# Altium schematic sheet 05 POWER DOMAIN.SchDoc
size 513 x 386 mm
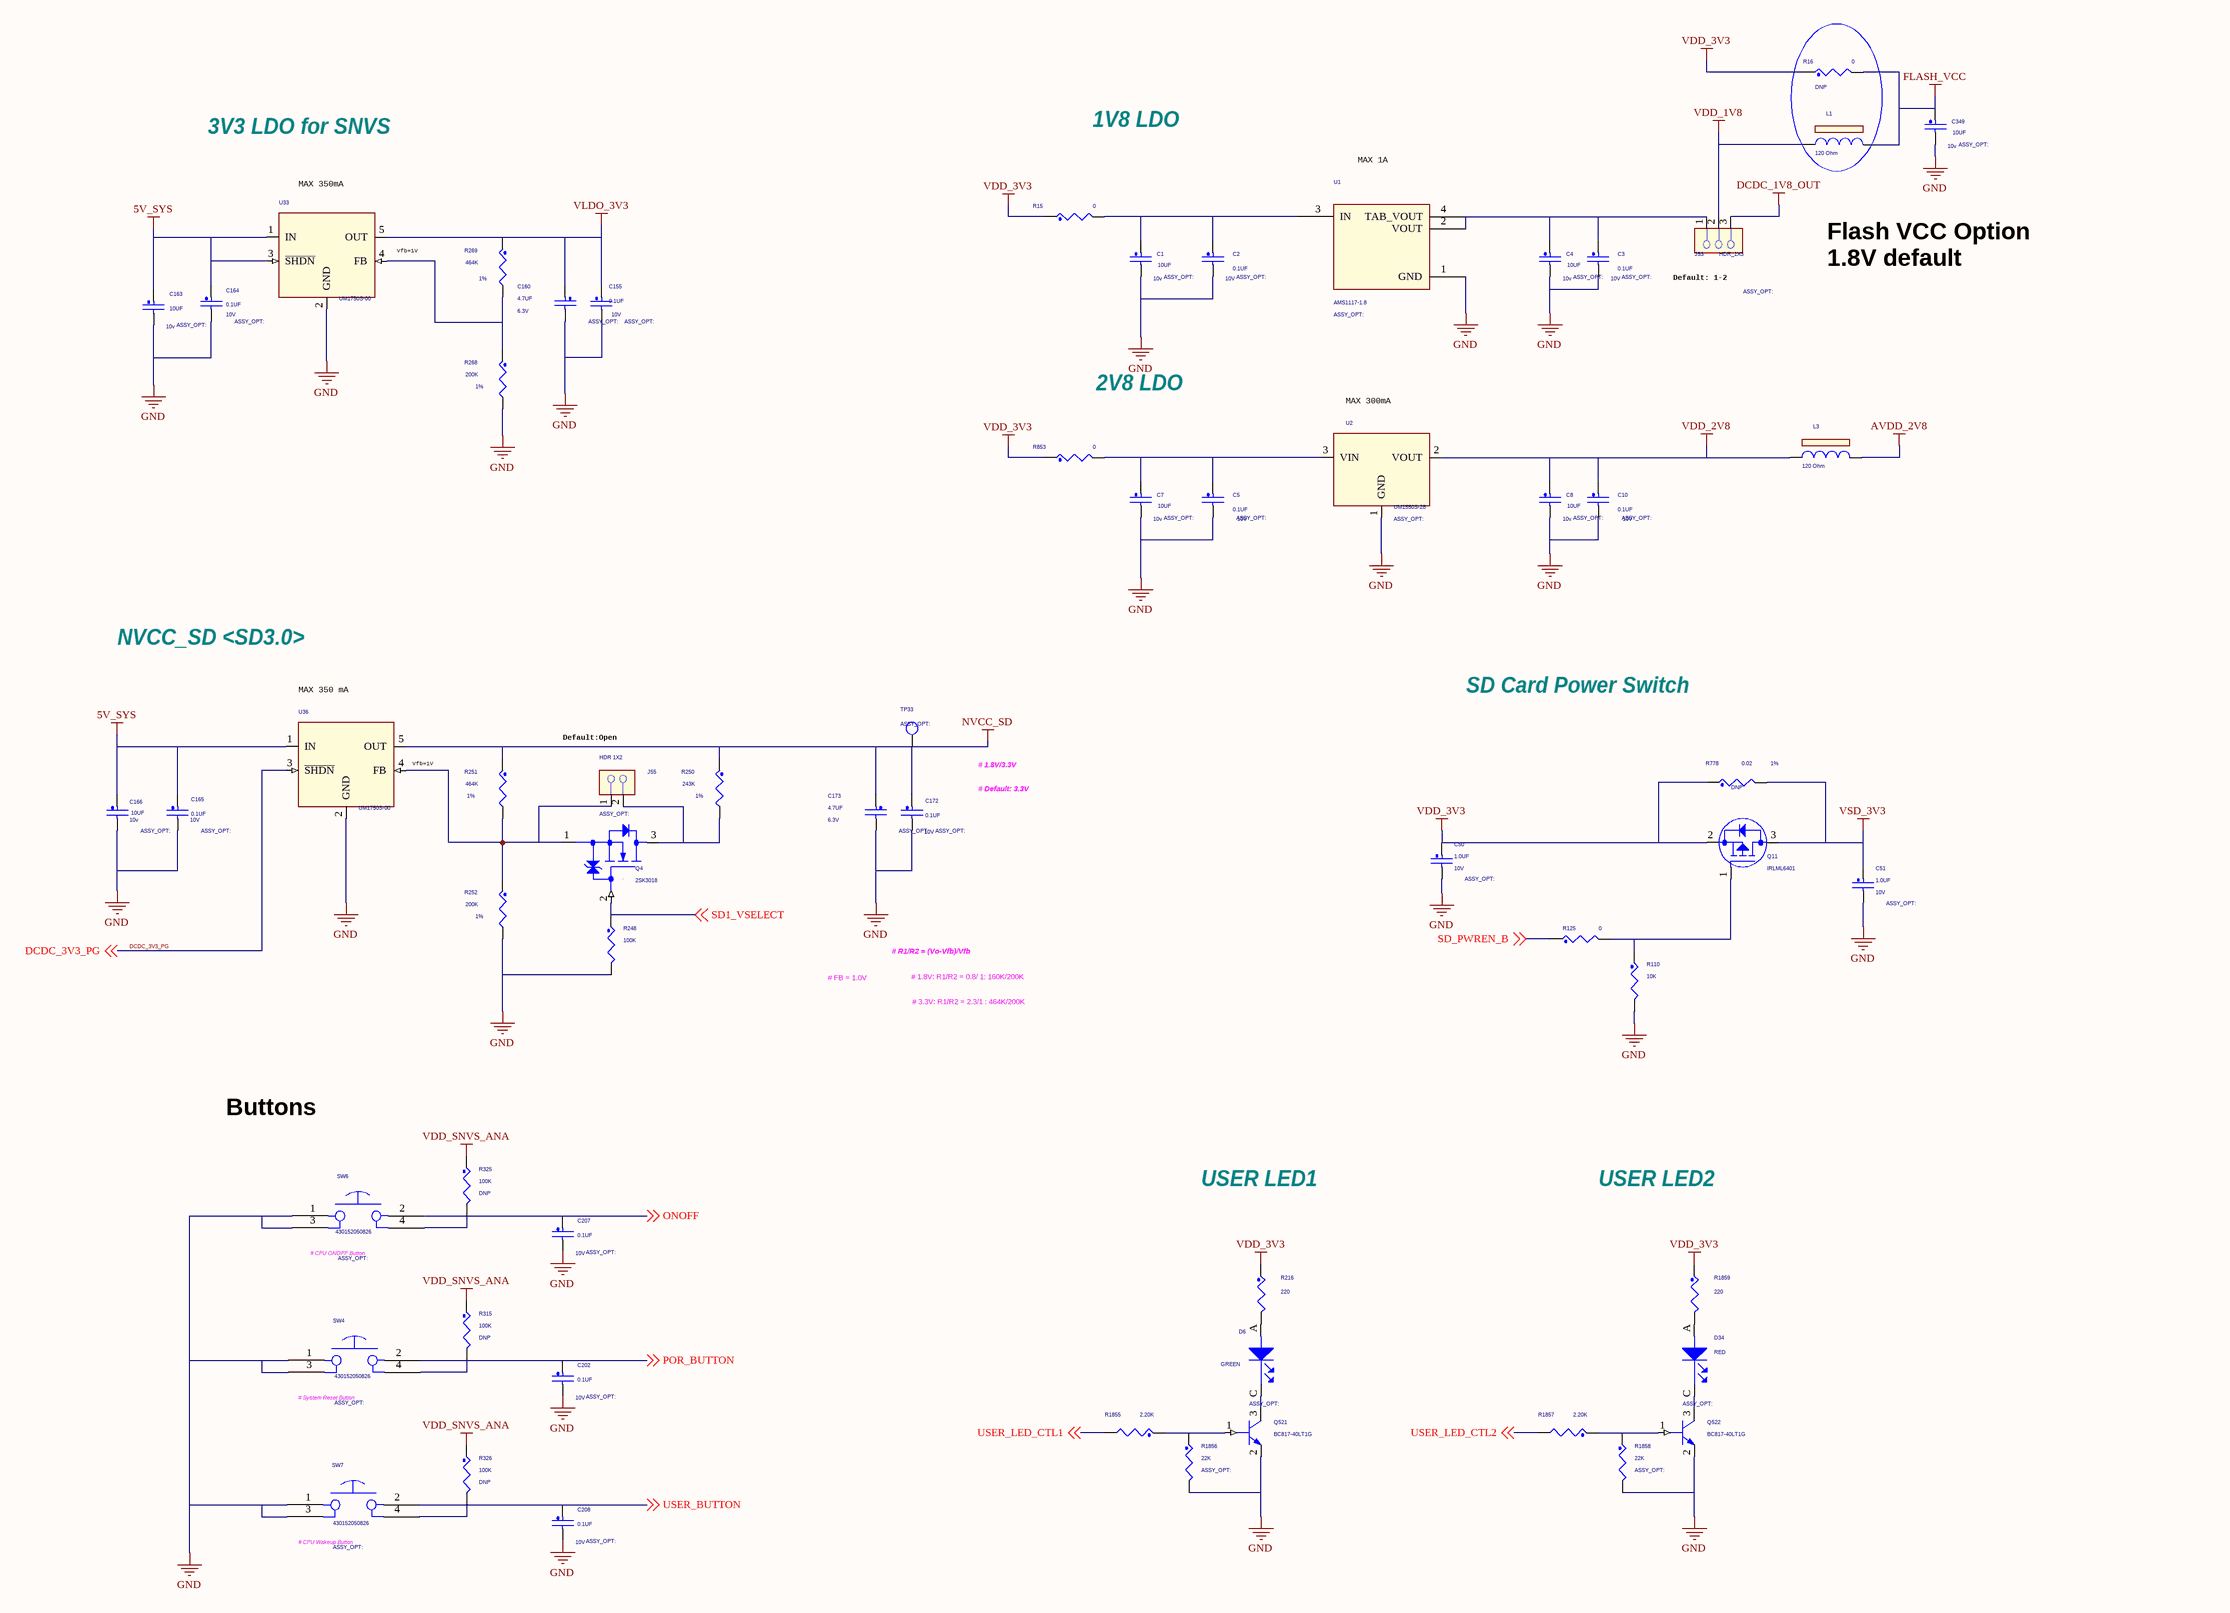
[diagram p0: 05 POWER DOMAIN.SchDoc]

## Parts
C1  10UF  VOLTAGE: 10v  [CC0603_OV]
C2  0.1UF  VOLTAGE: 10V  [0402_CC]
C3  0.1UF  VOLTAGE: 10V  [0402_CC]
C4  10UF  VOLTAGE: 10v  [CC0603_OV]
C5  0.1UF  VOLTAGE: 10V  [0402_CC]
C7  10UF  VOLTAGE: 10v  [CC0603_OV]
C8  10UF  VOLTAGE: 10v  [CC0603_OV]
C10  0.1UF  VOLTAGE: 10V  [0402_CC]
C50  1.0UF  VOLTAGE: 10V  [0402_CC]
C51  1.0UF  VOLTAGE: 10V  [0402_CC]
C155  0.1UF  VOLTAGE: 10V  [0402_CC]
C160  4.7UF  voltage rating: 6.3V  [cc0402_tol0p15]
C163  10UF  VOLTAGE: 10v  [CC0603_OV]
C164  0.1UF  VOLTAGE: 10V  [0402_CC]
C165  0.1UF  VOLTAGE: 10V  [0402_CC]
C166  10UF  VOLTAGE: 10v  [CC0603_OV]
C172  0.1UF  VOLTAGE: 10V  [0402_CC]
C173  4.7UF  voltage rating: 6.3V  [cc0402_tol0p15]
C202  0.1UF  VOLTAGE: 10V  [0402_CC]
C207  0.1UF  VOLTAGE: 10V  [0402_CC]
C208  0.1UF  VOLTAGE: 10V  [0402_CC]
C349  10UF  VOLTAGE: 10v  [CC0603_OV]
D6  GREEN  [LED_0603]
D34  RED  [LED_0603]
J53  HDR_1X3  [HDR103]
J55  HDR 1X2  [HDR102]
L1  120 Ohm  [0402_CC]
L3  120 Ohm  [0402_CC]
Q4  2SK3018  [SOT323_3]
Q11  IRLML6401  [sot-23]
Q521  BC817-40LT1G  [SOT23]
Q522  BC817-40LT1G  [SOT23]
R15  0  [0402_CC]
R16  0  ASSY_OPT: DNP  [0402_CC]
R110  10K  [0402_CC]
R125  0  [0402_CC]
R216  220  [RC0603_OV]
R248  100K  [0402_CC]
R250  243K  Tolerance: 1%  [0402_CC]
R251  464K  Tolerance: 1%  [0402_CC]
R252  200K  Tolerance: 1%  [0402_CC]
R268  200K  Tolerance: 1%  [0402_CC]
R269  464K  Tolerance: 1%  [0402_CC]
R315  100K  ASSY_OPT: DNP  [0402_CC]
R325  100K  ASSY_OPT: DNP  [0402_CC]
R326  100K  ASSY_OPT: DNP  [0402_CC]
R778  0.02  TOL: 1%  ASSY_OPT: DNP  [RC0603_OV]
R853  0  [0402_CC]
R1855  2.20K  [RC0603_OV]
R1856  22K  [RC0402_25]
R1857  2.20K  [RC0603_OV]
R1858  22K  [RC0402_25]
R1859  220  [RC0603_OV]
SW4  430152050826  [sw4_pb_6p2sq_sm]
SW6  430152050826  [sw4_pb_6p2sq_sm]
SW7  430152050826  [sw4_pb_6p2sq_sm]
TP33  TP_35MIL  [testpoint_35mil]  (value not drawn)
U1  AMS1117-1.8  [sot223]
U2  UM1550S-28  [sot23-3-1p95]
U33  UM1750S-00  [sot23-5_a]
U36  UM1750S-00  [sot23-5_a]

## Nets
5V_SYS: C163.1 C164.1 C165.1 C166.1 U33.1(IN) U33.3(~{SHDN}) U36.1(IN)
AVDD_2V8: L3.2
DCDC_1V8_OUT: J53.3
FLASH_VCC: C349.1 L1.2 R16.2
GND: C1.2 C2.2 C3.2 C4.2 C5.2 C7.2 C8.2 C10.2 C50.2 C51.2 C155.2 C160.2 C163.2 C164.2 C165.2 C166.2 C172.2 C173.2 C202.2 C207.2 C208.2 C349.2 Q521.2(EMITTER) Q522.2(EMITTER) R110.2 R248.2 R252.2 R268.2 R1856.2 R1858.2 SW4.1 SW4.3 SW6.1 SW6.3 SW7.1 SW7.3 U1.1(GND) U2.1(GND) U33.2(GND) U36.2(GND)
NVCC_SD: C172.1 C173.1 R250.1 R251.1 TP33.1(TP) U36.5(OUT)
VDD_1V8: J53.2 L1.1
VDD_2V8: C8.1 C10.1 L3.1 U2.2(VOUT)
VDD_3V3: C50.1 Q11.2(SOURCE) R15.1 R16.1 R216.1 R778.1 R853.1 R1859.1
VDD_SNVS_ANA: R315.1 R325.1 R326.1
VLDO_3V3: C155.1 C160.1 R269.1 U33.5(OUT)
VSD_3V3: C51.1 Q11.3(DRAIN) R778.2
DCDC_3V3_PG: U36.3(~{SHDN}) ; off-sheet DCDC_3V3_PG
ONOFF: C207.1 R325.2 SW6.2 SW6.4 ; off-sheet ONOFF
POR_BUTTON: C202.1 R315.2 SW4.2 SW4.4 ; off-sheet POR_BUTTON
SD1_VSELECT: Q4.2(GATE) R248.1 ; off-sheet SD1_VSELECT
SD_PWREN_B: R125.1 ; off-sheet SD_PWREN_B
USER_BUTTON: C208.1 R326.2 SW7.2 SW7.4 ; off-sheet USER_BUTTON
USER_LED_CTL1: R1855.2 ; off-sheet USER_LED_CTL1
USER_LED_CTL2: R1857.2 ; off-sheet USER_LED_CTL2
NetC1_1: C1.1 C2.1 R15.2 U1.3(IN)
NetC3_1: C3.1 C4.1 J53.1 U1.2(VOUT) U1.4(TAB_VOUT)
NetC5_1: C5.1 C7.1 R853.2 U2.3(VIN)
NetD6_A: D6.A(ANODE) R216.2
NetD6_C: D6.C(CATHODE) Q521.3(COLLECTOR)
NetD34_A: D34.A(ANODE) R1859.2
NetD34_C: D34.C(CATHODE) Q522.3(COLLECTOR)
NetJ55_1: J55.1 Q4.1(SOURCE) R251.2 R252.1 U36.4(FB)
NetJ55_2: J55.2 Q4.3(DRAIN) R250.2
NetQ11_1: Q11.1(GATE) R110.1 R125.2
NetQ521_1: Q521.1(BASE) R1855.1 R1856.1
NetQ522_1: Q522.1(BASE) R1857.1 R1858.1
NetR268_1: R268.1 R269.2 U33.4(FB)

## Notes on the sheet
- 3V3 LDO for SNVS
- 1V8 LDO
- MAX 1A
- (near U33) MAX 350mA
- Flash VCC Option
  1.8V default
- (near U33) Vfb=1V
- (near J53) Default: 1-2
- 2V8 LDO
- MAX 300mA
- NVCC_SD <SD3.0>
- MAX 350 mA
- SD Card Power Switch
- (near U36) Vfb=1V
- Default:Open
- # 1.8V/3.3V
- # Default: 3.3V
- # R1/R2 = (Vo-Vfb)/Vfb
- # FB = 1.0V
- # 1.8V: R1/R2 = 0.8/ 1: 160K/200K
- # 3.3V: R1/R2 = 2.3/1 : 464K/200K
- Buttons
- USER LED1
- USER LED2
- (near SW6) # CPU ONOFF Button
- (near SW4) # System Reset Button
- (near SW7) # CPU Wakeup Button

## Library data of the parts
C1 C4 C163 C349 = CAP_NP: CAP CER 10UF 10V 10% X5R 0603; CLASS: DISCRETE; AGILE_PN: 150-78675; MFG_NAME01: MURATA; MFG_PN01: GRM188R61A106KE69D; Temp_Range: -55¡ãC ~ 85¡ãC; CAD_APPROVED: Yes; FPLIST: CC0603_OV,CC0603,0603_CC; Tolerance: 10%; ROHS: Yes; HEIGHT: 1.016MM; Temp Range: -55¡ãC ~ 85¡ãC
C2 C3 C5 C10 C164 C172 C207 C208 = CAP_NP: CAP CER 0.1UF 10V 10% X5R 0402; CLASS: DISCRETE; AGILE_PN: 150-75634; MFG_NAME01: YAGEO AMERICA; MFG_PN01: CC0402KRX5R6BB104; CAD_APPROVED: Yes; FPLIST: CC0402_25,CC0402_HD,0402_CC; Tolerance: 10%; ROHS: Yes; HEIGHT: 0.64MM; Package Size: 0402
C7 C8 C166 = CAP_NP: CAP CER 10UF 10V 10% X5R 0603; CLASS: DISCRETE; FPLIST: CC0603_OV,CC0603,0603_CC; CAD_APPROVED: Yes; Temp_Range: -55¡ãC ~ 85¡ãC; MFG_PN01: GRM188R61A106KE69D; MFG_NAME01: MURATA; AGILE_PN: 150-78675; HEIGHT: 1.016MM; ROHS: Yes; Tolerance: 10%; Temp Range: -55¡ãC ~ 85¡ãC
C50 = CAP_NP: CAP CER 1.0UF 10V 10% X5R 0402; CLASS: DISCRETE; FPLIST: CC0402_25,CC0402_HD,0402_CC; CAD_APPROVED: Yes; MFG_PN01: CC0402KRX5R6BB105; MFG_NAME01: YAGEO AMERICA; AGILE_PN: 150-75772; HEIGHT: 0.6MM; ROHS: Yes; Package Size: 0402
C51 = CAP_NP: CAP CER 1.0UF 10V 10% X5R 0402; CLASS: DISCRETE; AGILE_PN: 150-75772; MFG_NAME01: YAGEO AMERICA; MFG_PN01: CC0402KRX5R6BB105; CAD_APPROVED: Yes; FPLIST: CC0402_25,CC0402_HD,0402_CC; ROHS: Yes; HEIGHT: 0.6MM; Package Size: 0402
C155 C165 C202 = CAP_NP: CAP CER 0.1UF 10V 10% X5R 0402; CLASS: DISCRETE; FPLIST: CC0402_25,CC0402_HD,0402_CC; CAD_APPROVED: Yes; MFG_PN01: CC0402KRX5R6BB104; MFG_NAME01: YAGEO AMERICA; AGILE_PN: 150-75634; HEIGHT: 0.64MM; ROHS: Yes; Tolerance: 10%; Package Size: 0402
C160 = CAP_NP: CAP CER 4.7UF 6.3V 20% X5R 0402; CLASS: DISCRETE; FPLIST: CC0402_25,CC0402_HD,0402_CC; CAD_APPROVED: Yes; MFG_PN01: C1005X5R0J475M050BC; MFG_NAME01: TDK; AGILE_PN: 150-78463; HEIGHT: 0.65MM; ROHS: Yes; Tolerance: 20%; VOLTAGE: 6.3V
C173 = CAP_NP: CAP CER 4.7UF 6.3V 20% X5R 0402; CLASS: DISCRETE; AGILE_PN: 150-78463; MFG_NAME01: TDK; MFG_PN01: C1005X5R0J475M050BC; CAD_APPROVED: Yes; FPLIST: CC0402_25,CC0402_HD,0402_CC; VOLTAGE: 6.3V; Tolerance: 20%; ROHS: Yes; HEIGHT: 0.65MM
D6 = LED: LED GRN SGL 25MA 0603; CLASS: IC; CAD_APPROVED: Yes; MFG_PN01: KPT-1608SGC; MFG_NAME01: KINGBRIGHT; AGILE_PN: 370-76549; HEIGHT: 0.85MM; ROHS: Yes
D34 = LED: LED ULTRA BRIGHT RED SGL 30MA 0603; CLASS: IC; Temp_Range: -30¡ã C to + 85¡ã C; CAD_APPROVED: Yes; MFG_PN01: LTST-C190KRKT; MFG_NAME01: LITE ON; AGILE_PN: 370-75079; Rated Voltage: 2V; HEIGHT: 0.9MM; ROHS: Yes; VOLTAGE: 2V; Temp Range: -30¡ã C to + 85¡ã C
J53 = CONN_HDR_3X1: HDR 1X3 TH 100MIL SP 338H AU 98L; CLASS: IO; CAD_APPROVED: Yes; Temp_Range: -55¡ãC to +105¡ãC; MFG_PN01: 0901S0203011N9T-31RF; MFG_NAME01: ANYTRONIC CORPORATION LIMITED; AGILE_PN: 210-81491; HEIGHT: 8.59MM; ROHS: Yes; Temp Range: -55¡ãC to +105¡ãC
J55 = CONN_HDR_2X1: HDR 1X2 TH 100MIL SP 339H AU 98L; CLASS: IO; CAD_APPROVED: Yes; Temp_Range: -55¡ãC to +105¡ãC; MFG_PN01: 0901S0202011N9T-31RF; MFG_NAME01: ANYTRONIC CORPORATION LIMITED; AGILE_PN: 210-81490; HEIGHT: 8.59MM; ROHS: Yes; Temp Range: -55¡ãC to +105¡ãC
L1 L3 = INDUCTOR_FERRITE: IND FER BEAD 120 OHM@100MHZ 0.5A 25% 0402; PART_TYPE: FERRITE\BEAD; CLASS: DISCRETE; AGILE_PN: 180-77771; MFG_NAME01: MURATA; MFG_PN01: BLM15AG121SN1D; CAD_APPROVED: Yes; FPLIST: IND_0402,0402_CC; Tolerance: 25%; ROHS: Yes; HEIGHT: 0.55MM; Package Size: 0402
Q4 = 2SK3018: TRANS MOSFET N-CH 30V .1A SOT-323; CLASS: IC; CAD_APPROVED: Yes; MFG_PN01: 2SK3018T106; MFG_NAME01: ROHM; AGILE_PN: 480-75317; HEIGHT: 0.9MM; ROHS: Yes
Q11 = MOSFET_P: TRAN PMOS PWR 12V 4.3A SOT23; CLASS: IC; CAD_APPROVED: Yes; MFG_PN01: IRLML6401TRPBF; MFG_NAME01: INTERNATIONAL RECTIFIER; AGILE_PN: 480-77718; HEIGHT: 1.12MM; ROHS: Yes
Q521 Q522 = NPN: TRAN NPN GEN 45V 0.5A SOT-23; CLASS: IC; CAD_APPROVED: Yes; MFG_NAME01: ON SEMICONDUCTOR; AGILE_PN: 480-75158; HEIGHT: 1.11 MM; ROHS: Yes; MFG_PN01: BC817-40LT1G
R15 R125 R853 = RES_Dup1: RES MF ZERO OHM 1/16W 5% 0402; CLASS: DISCRETE; AGILE_PN: 470-75394; MFG_NAME01: YAGEO AMERICA; MFG_PN01: RC0402JR-070RL; CAD_APPROVED: Yes; FPLIST: RC0402_25,RC0402_HD,RC0402_X2,0402_CC; HEIGHT: 0.45 MM; Tolerance: 5%; ROHS: Yes; VOLTAGE: 1/16W
R16 = RES_Dup1: RES MF ZERO OHM 1/16W 5% 0402; CLASS: DISCRETE; FPLIST: RC0402_25,RC0402_HD,RC0402_X2,0402_CC; CAD_APPROVED: Yes; MFG_PN01: RC0402JR-070RL; MFG_NAME01: YAGEO AMERICA; AGILE_PN: 470-75394; ROHS: Yes; Tolerance: 5%; HEIGHT: 0.45 MM; VOLTAGE: 1/16W
R110 = RES_Dup1: RES MF 10K 1/16W 5% 0402; CLASS: DISCRETE; AGILE_PN: 470-75557; MFG_NAME01: VISHAY INTERTECHNOLOGY; MFG_PN01: CRCW040210K0JNED; CAD_APPROVED: Yes; FPLIST: RC0402_25,RC0402_HD,0402_CC; HEIGHT: 0.4 MM; Tolerance: 5%; ROHS: Yes
R216 R1859 = RES_Dup1: RES MF 220 OHM 1/10W 5% 0603; CLASS: DISCRETE; AGILE_PN: 470-30297; MFG_NAME01: YAGEO AMERICA; MFG_PN01: RC0603JR-07220RL; CAD_APPROVED: Yes; FPLIST: RC0603_OV,RC0603,0603_CC; Tolerance: 5%; ROHS: Yes; HEIGHT: 0.6MM
R248 = RES_Dup1: RES MF 100K 1/16W 5% 0402; CLASS: DISCRETE; AGILE_PN: 470-75597; MFG_NAME01: VENKEL COMPANY; MFG_PN01: CR0402-16W-104JT; CAD_APPROVED: Yes; FPLIST: RC0402_25,RC0402_HD,0402_CC; Temp_Range: -55C to +155C; VOLTAGE: 50V; HEIGHT: 0.40 MM; Tolerance: 5%; ROHS: Yes; Temp Range: -55C to +155C
R250 = RES_Dup1: RES MF 243K 1/10W 1% AEC-Q200 0402; CLASS: DISCRETE; Temp_Range: -55C to +155C; AGILE_PN: 470-31102; MFG_NAME01: KOA SPEER; MFG_PN01: RK73H1ETTP2433F; CAD_APPROVED: Yes; FPLIST: RC0402_25,RC0402_HD,0402_CC; ROHS: Yes; HEIGHT: 0.40 MM; Temp Range: -55C to +155C
R251 R269 = RES_Dup1: RES MF 464K 1/10W 1% AEC-Q200 0402; CLASS: DISCRETE; Temp_Range: -55C to +155C; FPLIST: RC0402_25,RC0402_HD,0402_CC; CAD_APPROVED: Yes; MFG_PN01: RK73H1ETTP4643F; MFG_NAME01: KOA SPEER; AGILE_PN: 470-31135; VOLTAGE: 50V; HEIGHT: 0.40 MM; ROHS: Yes; Temp Range: -55C to +155C
R252 = RES_Dup1: RES MF 200K 1/10W 1% AEC-Q200 0402; CLASS: DISCRETE; AGILE_PN: 470-31093; MFG_NAME01: KOA SPEER; MFG_PN01: RK73H1ETTP2003F; CAD_APPROVED: Yes; FPLIST: RC0402_25,RC0402_HD,0402_CC; Temp_Range: -55C to +155C; HEIGHT: 0.40 MM; ROHS: Yes; Temp Range: -55C to +155C
R268 = RES_Dup1: RES MF 200K 1/10W 1% AEC-Q200 0402; CLASS: DISCRETE; Temp_Range: -55C to +155C; FPLIST: RC0402_25,RC0402_HD,0402_CC; CAD_APPROVED: Yes; MFG_PN01: RK73H1ETTP2003F; MFG_NAME01: KOA SPEER; AGILE_PN: 470-31093; ROHS: Yes; HEIGHT: 0.40 MM; Temp Range: -55C to +155C
R315 R325 R326 = RES_Dup1: RES MF 100K 1/16W 5% 0402; CLASS: DISCRETE; Temp_Range: -55C to +155C; FPLIST: RC0402_25,RC0402_HD,0402_CC; CAD_APPROVED: Yes; MFG_PN01: CR0402-16W-104JT; MFG_NAME01: VENKEL COMPANY; AGILE_PN: 470-75597; VOLTAGE: 50V; ROHS: Yes; Tolerance: 5%; HEIGHT: 0.40 MM; Temp Range: -55C to +155C
R778 = RES: RES MF 0.02 OHM 1/10W 1% 0603; CLASS: DISCRETE; AGILE_PN: 470-80199; MFG_NAME01: VISHAY INTERTECHNOLOGY; MFG_PN01: WSL0603R0200FEA; CAD_APPROVED: Yes; FPLIST: RC0603_OV,RC0603,0603_CC; ROHS: Yes; HEIGHT: 0.457MM; Tolerance: 1%
R1855 R1857 = RES_Dup1: RES MF 2.20K 1/10W 1% 0603; CLASS: DISCRETE; AGILE_PN: 470-75806; MFG_NAME01: BOURNS; MFG_PN01: CR0603-FX-2201ELF; CAD_APPROVED: Yes; FPLIST: RC0603_OV,RC0603,0603_CC; Tolerance: 1%; ROHS: Yes; HEIGHT: 0.55 MM
R1856 R1858 = RES_Dup1: RES MF 22K 1/16W 5% 0402; CLASS: DISCRETE; AGILE_PN: 470-75609; MFG_NAME01: SMEC; MFG_PN01: RC73L2Z223JTF; CAD_APPROVED: Yes; FPLIST: RC0402_25,RC0402_HD,0402_CC; Tolerance: 5%; ROHS: Yes; HEIGHT: 0.41mm
SW4 SW6 SW7 = EDGE_MOUNT_PB_SW_2: SW SPST PB NO 50MA 12V SMT; CLASS: IC; CAD_APPROVED: Yes; Temp_Range: -40 to 85 C; MFG_NAME01: WURTH ELEKTRONIK EISOS GMBH & CO. KG (ELECTRONIC & ELECTROMEHANICAL COMP); AGILE_PN: 510-78253; HEIGHT: 5.15MM; ROHS: Yes; MFG_PN01: 430152050826; Temp Range: -40 to 85 C
TP33 = T POINT R: TEST POINT PAD .035 SMT, no part to order; CLASS: IC; CAD_APPROVED: Yes; AGILE_PN: 510-75618; HEIGHT: 0.1MM; ROHS: Yes
U1 = LM1117_FXD: IC VREG LDO 1.8V 1A  SOT-223; CAD_APPROVED: Yes; Temp_Range: -40 to 125C; MFG_NAME01: ADVANCED MONOLITHIC SYSTEMS INC; AGILE_PN: 315-82022; CLASS: IC; HEIGHT: 1.8MM; ROHS: Yes; MFG_PN01: AMS1117-1.8; VOLTAGE: 1.8V; Temp Range: -40 to 125C
U2 = UM1550S_3P: IC LIN VREG LDO 2.8V 300mA 1.8-8V SOT-23-3; AGILE_PN: 315-81885; MFG_NAME01: UNION SEMICONDUCTOR, INC; Temp_Range: -40C to 125C; CAD_APPROVED: Yes; CLASS: IC; MFG_PN01: UM1550S-28; ROHS: Yes; HEIGHT: 1.4MM; VOLTAGE: 1.8-8V; Temp Range: -40C to 125C
U33 = UM1750S-00_5P: IC VREG LDO ADJ 1-5V 350mA 2.5-6V SOT23-5; AGILE_PN: 315-80554; MFG_NAME01: UNION SEMICONDUCTOR, INC; CAD_APPROVED: Yes; CLASS: IC; MFG_PN01: UM1750S-00; ROHS: Yes; HEIGHT: 1.25MM; VOLTAGE: 2.5-6V
U36 = UM1750S-00_5P: IC VREG LDO ADJ 1-5V 350mA 2.5-6V SOT23-5; CAD_APPROVED: Yes; MFG_NAME01: UNION SEMICONDUCTOR, INC; AGILE_PN: 315-80554; CLASS: IC; HEIGHT: 1.25MM; ROHS: Yes; MFG_PN01: UM1750S-00; VOLTAGE: 2.5-6V